# Altium schematic sheet Vapeix_mini_Shield.SchDoc: Vapeix Mini PCB - Interface
size A3; DrawnBy: Anne Moller; Organization: Altium Limited; Address1: L3, 12a Rodborough Rd; Address2: Frenchs Forest; Address3: NSW; Address4: Australia 2086
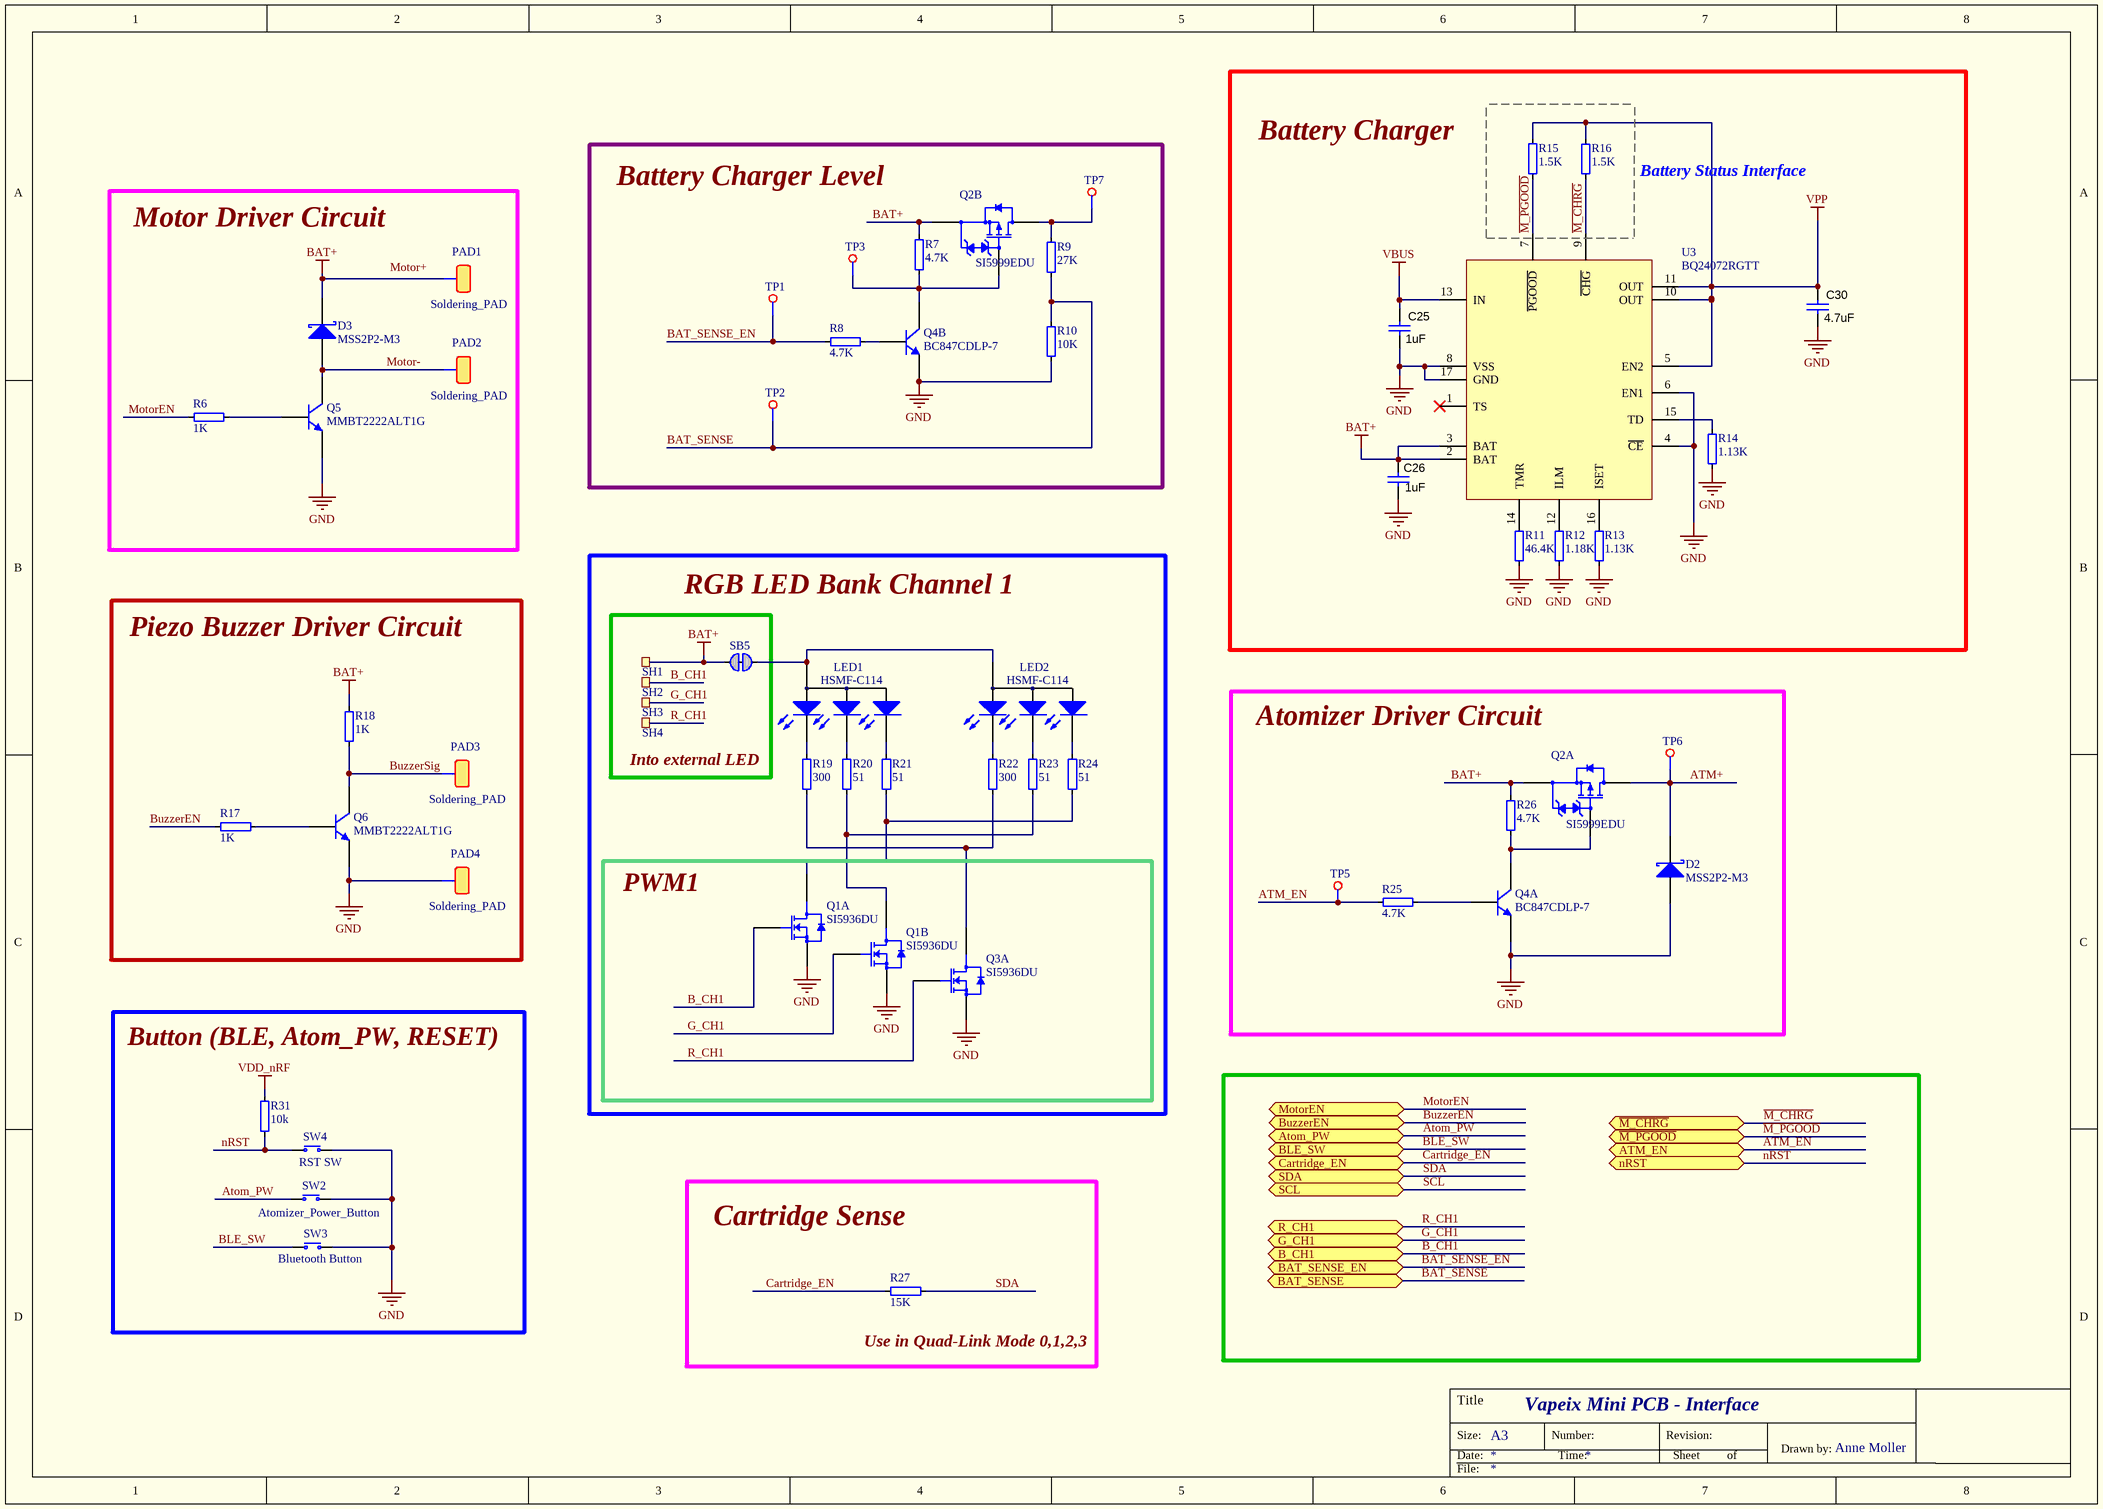
[diagram p0: Vapeix_mini_Shield.SchDoc]

## Parts
C25  ValueDisplayed: 1uF  [CAPC1608X06L]
C26  ValueDisplayed: 1uF  [CAPC1608X06L]
C30  ValueDisplayed: 4.7uF  [CAPC1608X06L]
D2  MSS2P2-M3  [MSS2P2-M3]
D3  MSS2P2-M3  [MSS2P2-M3]
LED1  HSMF-C114  [HSMF-C114]
LED2  HSMF-C114  [HSMF-C114]
PAD1  Soldering_PAD  [Soldering_PAD]
PAD2  Soldering_PAD  [Soldering_PAD]
PAD3  Soldering_PAD  [Soldering_PAD]
PAD4  Soldering_PAD  [Soldering_PAD]
Q1  SI5936DU  [SI5936DU]  (parts A,B of 2)
Q2  SI5999EDU  [SI5999EDU]  (parts A,B of 2)
Q3  SI5936DU  [SI5936DU]  (part A of 2)
Q4  BC847CDLP-7  [BC847CDLP-7]  (parts A,B of 2)
Q5  MMBT2222ALT1G  [MMBT2222ALT1G]
Q6  MMBT2222ALT1G  [MMBT2222ALT1G]
R6  1K  [RESC1005X04L]
R7  4.7K  [RESC1005X04L]
R8  4.7K  [RESC1005X04L]
R9  27K  [RESC1005X04L]
R10  10K  [RESC1005X04L]
R11  46.4K  [RESC1005X04L]
R12  1.18K  [RESC1005X04L]
R13  1.13K  [RESC1005X04L]
R14  1.13K  [RESC1005X04L]
R15  1.5K  [RESC1005X04L]
R16  1.5K  [RESC1005X04L]
R17  1K  [RESC1005X04L]
R18  1K  [RESC1005X04L]
R19  300  [RESC1005X04L]
R20  51  [RESC1005X04L]
R21  51  [RESC1005X04L]
R22  300  [RESC1005X04L]
R23  51  [RESC1005X04L]
R24  51  [RESC1005X04L]
R25  4.7K  [RESC1005X04L]
R26  4.7K  [RESC1005X04L]
R27  15K  [RESC1005X04L]
R31  10k  [RESC1005X04L]
SB5  Solderbridge  [Solderbridge_Shorted]  (value not drawn)  (net tie, no BOM)
SH1  TP  [TESTPAD-TH]  (value not drawn)  (no BOM)
SH2  TP  [TESTPAD-TH]  (value not drawn)  (no BOM)
SH3  TP  [TESTPAD-TH]  (value not drawn)  (no BOM)
SH4  TP  [TESTPAD-TH]  (value not drawn)  (no BOM)
SW2  Atomizer_Power_Button  [ALPS_SKHUxxx010_WO_GND]
SW3  Bluetooth Button  [ALPS_SKHUxxx010_WO_GND]
SW4  RST SW  [ALPS_SKHUxxx010_WO_GND]
TP1  TP  [TP]  (value not drawn)
TP2  TP  [TP]  (value not drawn)
TP3  TP  [TP]  (value not drawn)
TP5  TP  [TP]  (value not drawn)
TP6  TP  [TP]  (value not drawn)
TP7  TP  [TP]  (value not drawn)
U3  BQ24072RGTT  [BQ24072RGTT]

## Ports
ATM_EN (bidir), Atom_PW (bidir), B_CH1 (bidir), BAT_SENSE, BAT_SENSE_EN (bidir), BLE_SW (bidir), BuzzerEN (bidir), Cartridge_EN (bidir), G_CH1 (bidir), MotorEN (bidir), nRST (bidir), R_CH1 (bidir), SCL (bidir), SDA (bidir), ~{M_CHRG} (bidir), ~{M_PGOOD} (bidir)

## Nets
BAT+: C26.1 D3.2(K) PAD1.1(TP) Q2.1(S1) Q2.3(S2) R7.1 R18.1 R26.2 SB5.2 SH1.1 U3.2(BAT) U3.3(BAT)
GND: C25.2 C26.2 C30.2 D2.1(A) PAD4.1(TP) Q1.1(S1) Q1.3(S2) Q3.1(S1) Q4.1(E1) Q4.4(E2) Q5.2(E) Q6.2(E) R10.2 R11.2 R12.2 R13.2 R14.2 SW2.2(COM) SW3.2(COM) SW4.2(COM) U3.4(~{CE}) U3.6(EN1) U3.8(VSS) U3.17(GND)
VBUS: C25.1 U3.13(IN)
VDD_nRF: R31.2
VPP: C30.1 R15.1 R16.1 U3.5(EN2) U3.10(OUT) U3.11(OUT)
ATM+: D2.2(K) Q2.7(D1) TP6.1(TP)
ATM_EN: R25.1 TP5.1(TP) ; port ATM_EN
Atom_PW: SW2.1(N.O) ; port Atom_PW
B_CH1: Q1.2(G1) SH2.1 ; port B_CH1
BAT_SENSE: R9.2 R10.1 TP2.1(TP) ; port BAT_SENSE
BAT_SENSE_EN: R8.2 TP1.1(TP) ; port BAT_SENSE_EN
BLE_SW: SW3.1(N.O) ; port BLE_SW
BuzzerEN: R17.2 ; port BuzzerEN
BuzzerSig: PAD3.1(TP) Q6.3(C) R18.2
Cartridge_EN: R27.2 ; port Cartridge_EN
G_CH1: Q1.4(G2) SH3.1 ; port G_CH1
~{M_CHRG}: R16.2 U3.9(~{CHG}) ; port ~{M_CHRG}
~{M_PGOOD}: R15.2 U3.7(~{PGOOD}) ; port ~{M_PGOOD}
Motor-: D3.1(A) PAD2.1(TP) Q5.3(C)
MotorEN: R6.2 ; port MotorEN
nRST: R31.1 SW4.1(N.O) ; port nRST
R_CH1: Q3.2(G1) SH4.1 ; port R_CH1
SCL: port SCL
SDA: R27.1 ; port SDA
NetLED1_1: LED1.1(ANODE) LED2.1(ANODE) SB5.1
NetLED1_2: LED1.2(RED) R19.1
NetLED1_3: LED1.3(GREEN) R20.1
NetLED1_4: LED1.4(BLUE) R21.1
NetLED2_2: LED2.2(RED) R22.1
NetLED2_3: LED2.3(GREEN) R23.1
NetLED2_4: LED2.4(BLUE) R24.1
NetQ1_5: Q1.5(D2) R20.2 R23.2
NetQ1_7: Q1.7(D1) R21.2 R24.2
NetQ2_2: Q2.2(G1) Q4.3(C1) R26.1
NetQ2_4: Q2.4(G2) Q4.6(C2) R7.2 TP3.1(TP)
NetQ2_5: Q2.5(D2) R9.1 TP7.1(TP)
NetQ3_7: Q3.7(D1) R19.2 R22.2
NetQ4_2: Q4.2(B1) R25.2
NetQ4_5: Q4.5(B2) R8.1
NetQ5_1: Q5.1(B) R6.1
NetQ6_1: Q6.1(B) R17.1
NetR11_1: R11.1 U3.14(TMR)
NetR12_1: R12.1 U3.12(ILM)
NetR13_1: R13.1 U3.16(ISET)
NetR14_1: R14.1 U3.15(TD)

Not connected (* = marked no-connect by the designer): U3 1(TS)*

## Notes on the sheet
- Labels drawn without touching a wire or pin: Atomizer Driver Circuit, Battery Charger, Battery Charger Level, Battery Status Interface, Button (BLE, Atom_PW, RESET), Cartridge Sense, Into external LED, Motor Driver Circuit, Motor+, Piezo Buzzer Driver Circuit, PWM1, RGB LED Bank Channel 1, Use in Quad-Link Mode 0,1,2,3
- Title
- Size:
- Date:
- A3
- Number:
- Time:
- Revision:
- Sheet
- of
- Drawn by:
- File:

## Library data of the parts
C25 C26 C30 = GRM219R61A106KE44D: CAP, CERM, 10 µF, 10 V, +/- 10%, X5R, 0805; Manufacturer: MuRata; Polarized: N; CompType: Capacitor; Value: 10uF; U/M: EA; Cap_F: 0.00001; Tolerance_%: 10; ESR_ohm: 0.005; Value1: 0.005 ohm; Value2: 10V; TaMin_C: -55; TaMax_C: 85; Cap_Case: 0805; SymbolVersion: 2008-07-09; PartNumber: GRM219R61A106KE44D; PackageReference: 0805; RoHS: Y; VDC_V: 10; MountType: SMT; Technology: Ceramic; TempCo: X5R; Published: 2008-06-19; Publisher: Texas Instruments; LatestRevisionDate: 2014-08-19; ComponentLink1Description: Datasheet link; ComponentLink1URL: http://psearch.murata.com/capacitor/product/GRM219R61A106KE44%23.pdf; Supplier 1: Digi-Key; Supplier Part Number 1: 490-4735-1-ND; Supplier 2: Mouser; Supplier Part Number 2: 81-GRM219R61A106KE4D; Supplier 3: Farnell; Supplier Part Number 3: 1845741
D2 D3 = MSS2P2-M3/89A: DIODE SCHOTTKY 20V 2A MICROSMP; Manufacturer: Vishay Semiconductor Diodes Division; Voltage - Forward (Vf) (Max) @ If: 600mV @ 2A; Speed: Fast Recovery =< 500ns, > 200mA (Io); Current - Reverse Leakage @ Vr: 250µA @ 20V; Capacitance @ Vr, F: 65pF @ 4V, 1MHz; Supplier 1: Digi-Key; Manufacturer Part Number: MSS2P2-M3/89A; RoHS: RoHS Compliant; Category: Discrete Semiconductor Products; Stock 1: 3961; Pricing 1: 1=0.37, 10=0.274, 100=0.1552, 500=0.1029, 1000=0.07892 (USD); Packaging: Digi-Reel®; Diode Type: Schottky; Voltage - DC Reverse (Vr) (Max): 20V; Current - Average Rectified (Io): 2A; Reverse Recovery Time (trr): -; Mounting Type: Surface Mount; Package / Case: MicroSMP; Supplier Device Package: MicroSMP; Operating Temperature - Junction: -55°C ~ 150°C; ComponentLink1URL: http://www.vishay.com/docs/89054/mss2p3.pdf; ComponentLink1Description: http://www.vishay.com/docs/89054/mss2p3.pdf
LED1 LED2 = HSMF-C114: LED RGB DIFFUSED 0606 SMD; Manufacturer: Broadcom Limited; Color: Red, Green, Blue (RGB); Lens Color: White; Millicandela Rating: 85mcd Red, 180mcd Green, 70mcd Blue; Lens Style/Size: Rectangle with Flat Top, 1.10mm x 1.50mm; Voltage - Forward (Vf) (Typ): 1.9V Red, 3.4V Green, 3.4V Blue; Current - Test: 20mA Red, 20mA Green, 20mA Blue; Viewing Angle: 140° Red, 145° Green, 145° Blue; Wavelength - Dominant: 626nm Red, 525nm Green, 470nm Blue; Wavelength - Peak: 637nm Red, 523nm Green, 468nm Blue; Supplier 1: Digi-Key; Manufacturer Part Number: HSMF-C114; RoHS: RoHS Compliant; Category: Optoelectronics; Stock 1: 11787; Pricing 1: 1=2.03, 10=1.62, 25=1.2376, 100=1.125, 250=0.99, 500=0.8325, 1000=0.72 (USD); Packaging: Digi-Reel®; Lens Transparency: Diffused; Mounting Type: Surface Mount; Features: -; Package / Case: 0606 (1616 Metric); Supplier Device Package: Chip LED; Size / Dimension: 1.60mm L x 1.50mm W; Height (Max): 0.35mm; ComponentLink1URL: http://www.avagotech.com/docs/AV02-2451EN; ComponentLink1Description: http://www.avagotech.com/docs/AV02-2451EN
PAD1-PAD4 = Soldering_PAD: Soldering PAD
Q1 Q3 = SI5936DU-T1-GE3: MOSFET 2N-CH 30V 6A PWRPK CHPFET; Manufacturer: Vishay Siliconix; FET Type: 2 N-Channel (Dual); FET Feature: Logic Level Gate; Rds On (Max) @ Id, Vgs: 30 mOhm @ 5A, 10V; Vgs(th) (Max) @ Id: 2.2V @ 250µA; Gate Charge (Qg) @ Vgs: 11nC @ 10V; Input Capacitance (Ciss) @ Vds: 320pF @ 15V; Power - Max: 10.4W; Supplier 1: Digi-Key; Manufacturer Part Number: SI5936DU-T1-GE3; RoHS: RoHS Compliant; Category: Discrete Semiconductor Products; Stock 1: 0; Pricing 1: 1=0.66, 10=0.578, 100=0.442, 500=0.3502, 1000=0.2805 (USD); Packaging: Cut Tape (CT); Drain to Source Voltage (Vdss): 30V; Current - Continuous Drain (Id) @ 25°C: 6A; Operating Temperature: -55°C ~ 150°C (TJ); Mounting Type: Surface Mount; Package / Case: PowerPAK® ChipFET™ Dual; Supplier Device Package: PowerPAK® ChipFet Dual; ComponentLink1URL: http://www.vishay.com/docs/62804/si5936du.pdf; ComponentLink1Description: http://www.vishay.com/docs/62804/si5936du.pdf; Supplier Part Number 1: SI5936DU-T1-GE3CT-ND
Q2 = SI5999EDU-T1-GE3: MOSFET 2P-CH 20V 6A POWERPAK; Manufacturer: Vishay Siliconix; FET Type: 2 P-Channel (Dual); FET Feature: Logic Level Gate; Rds On (Max) @ Id, Vgs: 59 mOhm @ 3.5A, 4.5V; Vgs(th) (Max) @ Id: 1.5V @ 250µA; Gate Charge (Qg) @ Vgs: 20nC @ 10V; Input Capacitance (Ciss) @ Vds: 496pF @ 10V; Power - Max: 10.4W; Supplier 1: Digi-Key; Manufacturer Part Number: SI5999EDU-T1-GE3; RoHS: RoHS Compliant; Category: Discrete Semiconductor Products; Stock 1: 2994; Pricing 1: 1=0.58, 10=0.51, 100=0.39, 500=0.309, 1000=0.2475 (USD); Packaging: Cut Tape (CT); Drain to Source Voltage (Vdss): 20V; Current - Continuous Drain (Id) @ 25°C: 6A; Operating Temperature: -55°C ~ 150°C (TJ); Mounting Type: Surface Mount; Package / Case: PowerPAK® ChipFET™ Dual; Supplier Device Package: PowerPAK® ChipFet Dual; ComponentLink1URL: http://www.vishay.com/docs/67019/si5999ed.pdf; ComponentLink1Description: http://www.vishay.com/docs/67019/si5999ed.pdf
Q4 = BC847CDLP-7: TRANS 2NPN 45V 0.1A 6DFN; Manufacturer: Diodes Incorporated; Transistor Type: 2 NPN (Dual); Current - Collector (Ic) (Max): 100mA; Vce Saturation (Max) @ Ib, Ic: 600mV @ 5mA, 100mA; Current - Collector Cutoff (Max): 15nA; DC Current Gain (hFE) (Min) @ Ic, Vce: 420 @ 2mA, 5V; Power - Max: 350mW; Frequency - Transition: 100MHz; Supplier 1: Digi-Key; Manufacturer Part Number: BC847CDLP-7; RoHS: RoHS Compliant; Category: Discrete Semiconductor Products; Stock 1: 11845; Pricing 1: 1=0.36, 10=0.29, 100=0.198, 500=0.1482, 1000=0.111 (USD); Packaging: Cut Tape (CT); Voltage - Collector Emitter Breakdown (Max): 45V; Mounting Type: Surface Mount; Package / Case: 6-SMD, No Lead; Supplier Device Package: 6-DFN1310H4 (1.0x1.3); ComponentLink1URL: http://www.diodes.com/_files/datasheets/ds30817.pdf; ComponentLink1Description: http://www.diodes.com/_files/datasheets/ds30817.pdf
Q5 Q6 = MMBT2222ALT1G: TRANS NPN 40V 0.6A SOT23; Manufacturer: ON Semiconductor; Current - Collector (Ic) (Max): 600mA; Vce Saturation (Max) @ Ib, Ic: 1V @ 50mA, 500mA; Current - Collector Cutoff (Max): 10nA (ICBO); DC Current Gain (hFE) (Min) @ Ic, Vce: 100 @ 150mA, 10V; Power - Max: 300mW; Frequency - Transition: 300MHz; Supplier 1: Digi-Key; Manufacturer Part Number: MMBT2222ALT1G; RoHS: RoHS Compliant; Category: Discrete Semiconductor Products; Stock 1: 0; Pricing 1: 1=0.1, 10=0.095, 100=0.0516, 500=0.03172, 1000=0.02163 (USD); Packaging: Cut Tape (CT); Transistor Type: NPN; Voltage - Collector Emitter Breakdown (Max): 40V; Mounting Type: Surface Mount; Package / Case: TO-236-3, SC-59, SOT-23-3; Supplier Device Package: SOT-23; ComponentLink1URL: http://www.onsemi.com/pub_link/Collateral/MMBT2222LT1-D.PDF; ComponentLink1Description: http://www.onsemi.com/pub_link/Collateral/MMBT2222LT1-D.PDF
R6-R10 R17-R27 R31 = R0402-10k: Resistor, ±1%, 0.063W; Note: Chip Res 1%; Artikkelnr Noca: 27049097; Artikkelnr Simpro: N.A.; Part Number: R0402-10k; Manufacturer: *; Manufacturer Part Number: *; Datasheet: *; LatestRevisionDate: 2009-11-23; Pin Count: 2; Publisher: Nordic Semiconductor; Published: 2009-05-08; Supplier: Farnell; Supplier part number: 173-8864; 2nd source Supplier: *; 2nd source part number: *; Footprint Doc: 0402
  R6 R17 R18: Value: 1K
  R7 R8 R25 R26: Value: 4.7K
  R9: Value: 27K
  R10: Value: 10K
  R19 R22: Value: 300
  R20 R21 R23 R24: Value: 51
  R27: Value: 15K
  R31: Value: 10k
R11-R16 = R0402-10k: Resistor, ±1%, 0.063W; Value: 10K; Note: Chip Res 1%; Artikkelnr Noca: 27049097; Artikkelnr Simpro: N.A.; Part Number: R0402-10k; Manufacturer: *; Manufacturer Part Number: *; Datasheet: *; LatestRevisionDate: 2009-11-23; Pin Count: 2; Publisher: Nordic Semiconductor; Published: 2009-05-08; Supplier: Farnell; Supplier part number: 173-8864; 2nd source Supplier: *; 2nd source part number: *; Footprint Doc: 0402
SB5 = Solderbridge Shorted: Shorted Solderbridge; Artikkelnr Noca: N.A.; Part Number: Solderbridge Shorted; Manufacturer: *; Manufacturer Part Number: *; Datasheet: *; LatestRevisionDate: 2012-08-07; Pin Count: 2; Publisher: Nordic Semiconductor; Published: 2012-08-07; Value: Solderbridge; Note: *; Supplier: *; Supplier part number: *; 2nd source Supplier: *; 2nd source part number: *; Footprint Doc: Solderbridge_Shorted; Artikkelnr Simpro: N.A.
SH1-SH4 = TESTPAD_TH: Testpoint, through hole; Part Number: Testpoint TH; Artikkelnr Noca: N.A.; Manufacturer: *; Manufacturer Part Number: *; Datasheet: *; Footprint Doc: TESTPAD-TH; LatestRevisionDate: 2009-12-12; Pin Count: 1; Publisher: Nordic Semiconductor; Published: 2009-12-12; Value: TP; Note: *; Supplier: *; Supplier part number: *; 2nd source Supplier: *; 2nd source part number: *; Artikkelnr Simpro: N.A.
SW2 SW3 = ALPS_SKHUALE010: ALPS - SKHUALE010 - Tactile Switch, SPNO, SMD, 6.5x6.2x2.5mm; 2nd source part number: 688-SKHUALE010; Value: RST SW; Artikkelnr Noca: 50019001; Artikkelnr Simpro: N.A.; Part Number: ALPS_SKHUALE010; Manufacturer: Alps; Manufacturer Part Number: SKHUALE010; Datasheet: https://www1.elfa.se/data1/wwwroot/webroot/Z_DATA/03579000.pdf; LatestRevisionDate: 2010-02-01; Pin Count: 4; Publisher: Nordic Semiconductor; Published: 2010-02-01; Note: *; Supplier: Elfa; Supplier part number: 35-790-00; 2nd source Supplier: Mouser; Footprint Doc: ALPS_SKHUxxx010_WO_GND
SW4 = ALPS_SKHUALE010: ALPS - SKHUALE010 - Tactile Switch, SPNO, SMD, 6.5x6.2x2.5mm; 2nd source part number: 688-SKHUALE010; Artikkelnr Noca: 50019001; Artikkelnr Simpro: N.A.; Part Number: ALPS_SKHUALE010; Manufacturer: Alps; Manufacturer Part Number: SKHUALE010; Datasheet: https://www1.elfa.se/data1/wwwroot/webroot/Z_DATA/03579000.pdf; LatestRevisionDate: 2010-02-01; Pin Count: 4; Publisher: Nordic Semiconductor; Published: 2010-02-01; Value: RST SW; Note: *; Supplier: Elfa; Supplier part number: 35-790-00; 2nd source Supplier: Mouser; Footprint Doc: ALPS_SKHUxxx010_WO_GND
TP1-TP3 TP5-TP7 = TP: TEST POINT
U3 = BQ24072RGTT: TEXAS INSTRUMENTS - BQ24072RGTT - BATTERY CHARGER LI-ION, 1.5A, QFN-16; Input Voltage: 26; Battery Charge Voltage: 4.2; Charge Current Max: 1.2; Battery IC Case Style: QFN; No. of Pins: 16; No. of Series Cells: 1; Supplier 1: Newark; Manufacturer: TEXAS INSTRUMENTS; Manufacturer Part Number: BQ24072RGTT; RoHS: YES; Stock 1: 134; Pricing 1: 1=1.6, 10=1.6, 25=1.47, 50=1.47, 100=1.47 (USD); Battery Type: Li-Ion; Operating Temperature Min: -40 C; ComponentLink1URL: http://www.farnell.com/cad/1638885.zip; ComponentLink1Description: http://www.farnell.com/cad/1638885.zip; ComponentLink2URL: http://www.farnell.com/datasheets/2001589.pdf; ComponentLink2Description: http://www.farnell.com/datasheets/2001589.pdf; Supplier Part Number 1: 12P6258